# Altium schematic sheet ZHSD-ZYNQ.SchDoc
size A4; SheetNumber: 4; SheetTotal: 5
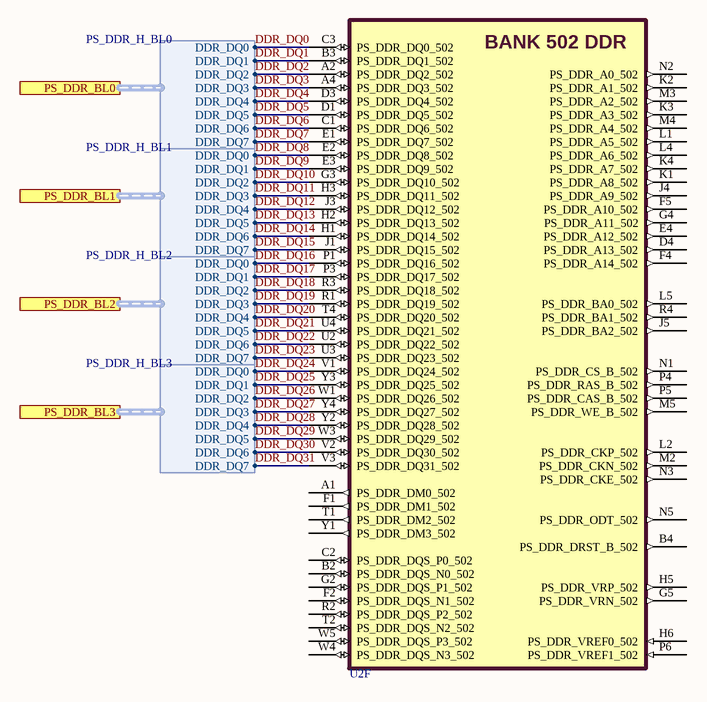
[diagram p0: ZHSD-ZYNQ.SchDoc]

## Parts
U2  XC7Z020-2CLG400I  [BGA400C80P20X20_1700X1700X147]  (value not drawn)  (part F of 8)

## Ports
PS_DDR_BL0 (harness PS_DDR_H_BL0, see ZHSD-Block[3A]), PS_DDR_BL1 (harness PS_DDR_H_BL1, see ZHSD-Block[3B]), PS_DDR_BL2 (harness PS_DDR_H_BL2, see ZHSD-Block[3B]), PS_DDR_BL3 (harness PS_DDR_H_BL3, see ZHSD-Block[3B])

## Harnesses
PS_DDR_H_BL0: DDR_DQ0, DDR_DQ1, DDR_DQ2, DDR_DQ3, DDR_DQ4, DDR_DQ5, DDR_DQ6, DDR_DQ7
PS_DDR_H_BL1: DDR_DQ0, DDR_DQ1, DDR_DQ2, DDR_DQ3, DDR_DQ4, DDR_DQ5, DDR_DQ6, DDR_DQ7
PS_DDR_H_BL2: DDR_DQ0, DDR_DQ1, DDR_DQ2, DDR_DQ3, DDR_DQ4, DDR_DQ5, DDR_DQ6, DDR_DQ7
PS_DDR_H_BL3: DDR_DQ0, DDR_DQ1, DDR_DQ2, DDR_DQ3, DDR_DQ4, DDR_DQ5, DDR_DQ6, DDR_DQ7

## Nets
DDR_DQ0: U2.C3(PS_DDR_DQ0_502) ; port PS_DDR_BL0.DDR_DQ0
DDR_DQ1: U2.B3(PS_DDR_DQ1_502) ; port PS_DDR_BL0.DDR_DQ1
DDR_DQ2: U2.A2(PS_DDR_DQ2_502) ; port PS_DDR_BL0.DDR_DQ2
DDR_DQ3: U2.A4(PS_DDR_DQ3_502) ; port PS_DDR_BL0.DDR_DQ3
DDR_DQ4: U2.D3(PS_DDR_DQ4_502) ; port PS_DDR_BL0.DDR_DQ4
DDR_DQ5: U2.D1(PS_DDR_DQ5_502) ; port PS_DDR_BL0.DDR_DQ5
DDR_DQ6: U2.C1(PS_DDR_DQ6_502) ; port PS_DDR_BL0.DDR_DQ6
DDR_DQ7: U2.E1(PS_DDR_DQ7_502) ; port PS_DDR_BL0.DDR_DQ7
DDR_DQ8: U2.E2(PS_DDR_DQ8_502) ; port PS_DDR_BL1.DDR_DQ0
DDR_DQ9: U2.E3(PS_DDR_DQ9_502) ; port PS_DDR_BL1.DDR_DQ1
DDR_DQ10: U2.G3(PS_DDR_DQ10_502) ; port PS_DDR_BL1.DDR_DQ2
DDR_DQ11: U2.H3(PS_DDR_DQ11_502) ; port PS_DDR_BL1.DDR_DQ3
DDR_DQ12: U2.J3(PS_DDR_DQ12_502) ; port PS_DDR_BL1.DDR_DQ4
DDR_DQ13: U2.H2(PS_DDR_DQ13_502) ; port PS_DDR_BL1.DDR_DQ5
DDR_DQ14: U2.H1(PS_DDR_DQ14_502) ; port PS_DDR_BL1.DDR_DQ6
DDR_DQ15: U2.J1(PS_DDR_DQ15_502) ; port PS_DDR_BL1.DDR_DQ7
DDR_DQ16: U2.P1(PS_DDR_DQ16_502) ; port PS_DDR_BL2.DDR_DQ0
DDR_DQ17: U2.P3(PS_DDR_DQ17_502) ; port PS_DDR_BL2.DDR_DQ1
DDR_DQ18: U2.R3(PS_DDR_DQ18_502) ; port PS_DDR_BL2.DDR_DQ2
DDR_DQ19: U2.R1(PS_DDR_DQ19_502) ; port PS_DDR_BL2.DDR_DQ3
DDR_DQ20: U2.T4(PS_DDR_DQ20_502) ; port PS_DDR_BL2.DDR_DQ4
DDR_DQ21: U2.U4(PS_DDR_DQ21_502) ; port PS_DDR_BL2.DDR_DQ5
DDR_DQ22: U2.U2(PS_DDR_DQ22_502) ; port PS_DDR_BL2.DDR_DQ6
DDR_DQ23: U2.U3(PS_DDR_DQ23_502) ; port PS_DDR_BL2.DDR_DQ7
DDR_DQ24: U2.V1(PS_DDR_DQ24_502) ; port PS_DDR_BL3.DDR_DQ0
DDR_DQ25: U2.Y3(PS_DDR_DQ25_502) ; port PS_DDR_BL3.DDR_DQ1
DDR_DQ26: U2.W1(PS_DDR_DQ26_502) ; port PS_DDR_BL3.DDR_DQ2
DDR_DQ27: U2.Y4(PS_DDR_DQ27_502) ; port PS_DDR_BL3.DDR_DQ3
DDR_DQ28: U2.Y2(PS_DDR_DQ28_502) ; port PS_DDR_BL3.DDR_DQ4
DDR_DQ29: U2.W3(PS_DDR_DQ29_502) ; port PS_DDR_BL3.DDR_DQ5
DDR_DQ30: U2.V2(PS_DDR_DQ30_502) ; port PS_DDR_BL3.DDR_DQ6
DDR_DQ31: U2.V3(PS_DDR_DQ31_502) ; port PS_DDR_BL3.DDR_DQ7

Not connected (* = marked no-connect by the designer): U2 A1(PS_DDR_DM0_502) B2(PS_DDR_DQS_N0_502) B4(PS_DDR_DRST_B_502) C2(PS_DDR_DQS_P0_502) D4(PS_DDR_A13_502) E4(PS_DDR_A12_502) F1(PS_DDR_DM1_502) F2(PS_DDR_DQS_N1_502) F4(PS_DDR_A14_502) F5(PS_DDR_A10_502) G2(PS_DDR_DQS_P1_502) G4(PS_DDR_A11_502) G5(PS_DDR_VRN_502) H5(PS_DDR_VRP_502) H6(PS_DDR_VREF0_502) J4(PS_DDR_A9_502) J5(PS_DDR_BA2_502) K1(PS_DDR_A8_502) K2(PS_DDR_A1_502) K3(PS_DDR_A3_502) K4(PS_DDR_A7_502) L1(PS_DDR_A5_502) L2(PS_DDR_CKP_502) L4(PS_DDR_A6_502) L5(PS_DDR_BA0_502) M2(PS_DDR_CKN_502) M3(PS_DDR_A2_502) M4(PS_DDR_A4_502) M5(PS_DDR_WE_B_502) N1(PS_DDR_CS_B_502) N2(PS_DDR_A0_502) N3(PS_DDR_CKE_502) N5(PS_DDR_ODT_502) P4(PS_DDR_RAS_B_502) P5(PS_DDR_CAS_B_502) P6(PS_DDR_VREF1_502) R2(PS_DDR_DQS_P2_502) R4(PS_DDR_BA1_502) T1(PS_DDR_DM2_502) T2(PS_DDR_DQS_N2_502) W4(PS_DDR_DQS_N3_502) W5(PS_DDR_DQS_P3_502) Y1(PS_DDR_DM3_502)

## Notes on the sheet
- (in symbol XC7Z020-2CLG400I, part F) BANK 502 DDR

## Library data of the parts
U2 = XC7Z020-2CLG400I: Dual ARM® Cortex®-A9 MPCore™ with CoreSight™ System On Chip (SOC) IC Zynq®-7000 Artix™-7 FPGA, 85K Logic Cells 766MHz 400-CSPBGA (17x17); Manufacturer: AMD/XILINX; Manufacturer Part Number: XC7Z020-2CLG400I; ComponentLink1Description: Datasheet; ComponentLink1URL: https://docs.amd.com/v/u/en-US/ds190-Zynq-7000-Overview; ComponentLink2Description: DC and AC Switching Characteristics; ComponentLink2URL: https://docs.amd.com/v/u/en-US/ds187-XC7Z010-XC7Z020-Data-Sheet; ComponentLink3Description: PCB Design Guide; ComponentLink3URL: https://docs.amd.com/v/u/en-US/ug933-Zynq-7000-PCB; ComponentLink4Description: Packaging and Pinout; ComponentLink4URL: https://docs.amd.com/v/u/en-US/ug865-Zynq-7000-Pkg-Pinout; ComponentLink5Description: Zynq 7000 SoC Technical Reference Manual; ComponentLink5URL: https://docs.amd.com/r/en-US/ug585-zynq-7000-SoC-TRM